# Altium schematic sheet SRAM_256Kx16_TSOP44.SchDoc: 256K x 16-Bit SRAM
size A4; SheetNumber: 14; SheetTotal: 19; PageSetup: Record=PageOptions|CenterHorizontal=True|CenterVertical=True|PrintScale=0.97|XCorrection=1.00|YCorrection=1.00|PrintKind=0|BorderSize=5000000|LeftOffset=0|BottomOffset=0|Orientation=2|PaperLength=1000|PaperWidth=1000|Scale=100|PaperSource=7|PrintQuality=-4|MediaType=1|DitherType=10|PaperKind=A4 (210 x 297mm)|PrintScaleMode=1
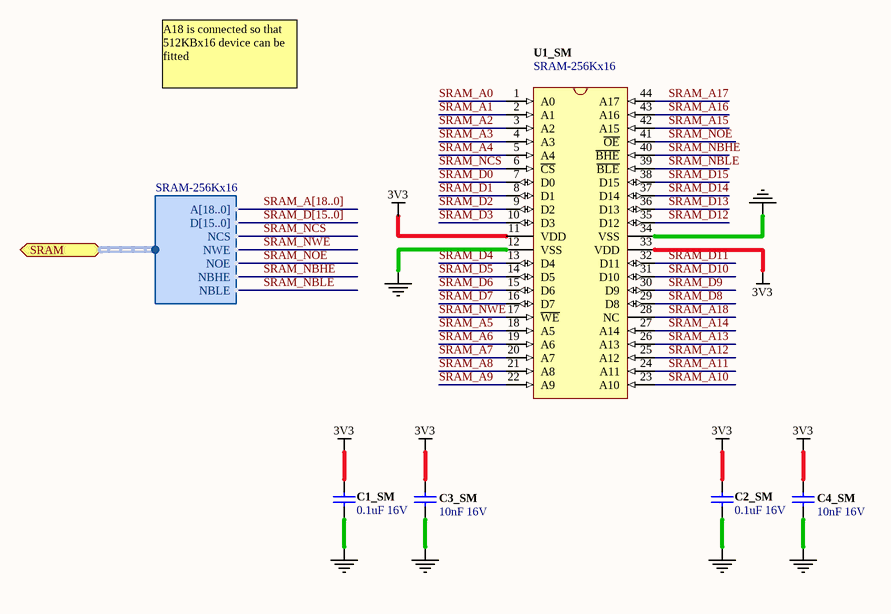
[diagram p0: SRAM_256Kx16_TSOP44.SchDoc]

## Parts
C1_SM  0.1uF 16V  [CAPC1005-STAR]
C2_SM  0.1uF 16V  [CAPC1005-STAR]
C3_SM  10nF 16V  [CAPC1005-STAR]
C4_SM  10nF 16V  [CAPC1005-STAR]
U1_SM  SRAM-256Kx16  [TSOP80P1176-44]

## Ports
SRAM (harness SRAM-256Kx16)

## Harnesses
SRAM-256Kx16: A[18..0], D[15..0], NCS, NWE, NOE, NBHE, NBLE

## Nets
3V3: C1_SM.1 C2_SM.1 C3_SM.1 C4_SM.1 U1_SM.11(VDD) U1_SM.33(VDD)
GND: C1_SM.2 C2_SM.2 C3_SM.2 C4_SM.2 U1_SM.12(VSS) U1_SM.34(VSS)
SRAM_A0: U1_SM.1(A0)
SRAM_A1: U1_SM.2(A1)
SRAM_A2: U1_SM.3(A2)
SRAM_A3: U1_SM.4(A3)
SRAM_A4: U1_SM.5(A4)
SRAM_A5: U1_SM.18(A5)
SRAM_A6: U1_SM.19(A6)
SRAM_A7: U1_SM.20(A7)
SRAM_A8: U1_SM.21(A8)
SRAM_A9: U1_SM.22(A9)
SRAM_A10: U1_SM.23(A10)
SRAM_A11: U1_SM.24(A11)
SRAM_A12: U1_SM.25(A12)
SRAM_A13: U1_SM.26(A13)
SRAM_A14: U1_SM.27(A14)
SRAM_A15: U1_SM.42(A15)
SRAM_A16: U1_SM.43(A16)
SRAM_A17: U1_SM.44(A17)
SRAM_A18: U1_SM.28(NC)
SRAM_D0: U1_SM.7(D0)
SRAM_D1: U1_SM.8(D1)
SRAM_D2: U1_SM.9(D2)
SRAM_D3: U1_SM.10(D3)
SRAM_D4: U1_SM.13(D4)
SRAM_D5: U1_SM.14(D5)
SRAM_D6: U1_SM.15(D6)
SRAM_D7: U1_SM.16(D7)
SRAM_D8: U1_SM.29(D8)
SRAM_D9: U1_SM.30(D9)
SRAM_D10: U1_SM.31(D10)
SRAM_D11: U1_SM.32(D11)
SRAM_D12: U1_SM.35(D12)
SRAM_D13: U1_SM.36(D13)
SRAM_D14: U1_SM.37(D14)
SRAM_D15: U1_SM.38(D15)
SRAM_NBHE: U1_SM.40(~{BHE}) ; port SRAM.NBHE
SRAM_NBLE: U1_SM.39(~{BLE}) ; port SRAM.NBLE
SRAM_NCS: U1_SM.6(~{CS}) ; port SRAM.NCS
SRAM_NOE: U1_SM.41(~{OE}) ; port SRAM.NOE
SRAM_NWE: U1_SM.17(~{WE}) ; port SRAM.NWE

## Buses and harness runs
bus SRAM_A[18..0]
bus SRAM_D[15..0]

## Notes on the sheet
- A18 is connected so that 512KBx16 device can be fitted
- Sheet Title
- Project Title
- Size:
- Date:
- A4
- Assy:
- Time:
- Sheet
- Revision:
- of
- File:

## Library data of the parts
C1_SM C2_SM = D-101-0080: Capacitor, Ceramic, 0.1uF 10% 16V 0402 (1005) X7R; Polarity: Non-Polarized; Category: Capacitor; Status: Production; Capacitance: 0.1 uF; Dielectric: X7R; Mounting Technology: Surface Mount; Rated Voltage: 16 V; Technology: Ceramic; Tolerance: 10 %
C3_SM C4_SM = D-101-0077: Capacitor, Ceramic, 10nF 10% 16V 0402 (1005) X7R; Polarity: Non-Polarized; Category: Capacitor; Status: Production; Capacitance: 10 nF; Dielectric: X7R; Mounting Technology: Surface Mount; Rated Voltage: 16 V; Technology: Ceramic; Tolerance: 10 %
U1_SM = D-260-0000: K6R4016V1D-TC10T, 256K x 16-Bit SRAM, TSOP44; Bit Length: 256K Bits; Bit Width: 16 Bits; Speed: ps; Supply Voltage: 3.3 V; Category: IC-SRAM; Status: Production; Mounting Technology: Surface Mount